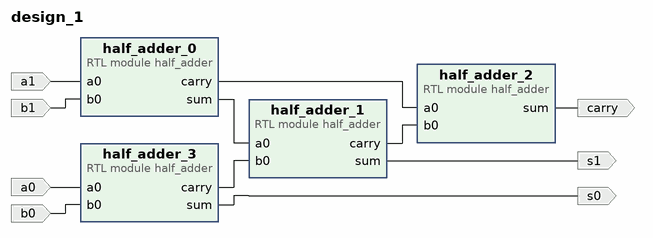
[diagram p0: block diagram of the top level]
# Vivado block design design_1, xc7a100tcsg324-1, Vivado 2017.2.1
create_bd_design design_1

create_bd_port -dir O carry
create_bd_port -dir O s0
create_bd_port -dir O s1
create_bd_port -dir I a0
create_bd_port -dir I b0
create_bd_port -dir I a1
create_bd_port -dir I b1

create_bd_cell -type module -reference half_adder half_adder_0
create_bd_cell -type module -reference half_adder half_adder_1
create_bd_cell -type module -reference half_adder half_adder_2
create_bd_cell -type module -reference half_adder half_adder_3

# ---- connections ----

connect_bd_net [get_bd_pins half_adder_0/carry] [get_bd_pins half_adder_2/a0]
connect_bd_net [get_bd_pins half_adder_0/sum] [get_bd_pins half_adder_1/a0]
connect_bd_net [get_bd_pins half_adder_1/carry] [get_bd_pins half_adder_2/b0]
connect_bd_net [get_bd_pins half_adder_2/sum] [get_bd_ports carry]
connect_bd_net [get_bd_pins half_adder_3/carry] [get_bd_pins half_adder_1/b0]
connect_bd_net [get_bd_pins half_adder_3/sum] [get_bd_ports s0]
connect_bd_net [get_bd_pins half_adder_1/sum] [get_bd_ports s1]
connect_bd_net -net a0_1 [get_bd_ports a0] [get_bd_pins half_adder_3/a0]
connect_bd_net -net b0_1 [get_bd_ports b0] [get_bd_pins half_adder_3/b0]
connect_bd_net -net a1_1 [get_bd_ports a1] [get_bd_pins half_adder_0/a0]
connect_bd_net -net b1_1 [get_bd_ports b1] [get_bd_pins half_adder_0/b0]

validate_bd_design
save_bd_design
